# EAGLE design ibm (EAGLE 9.6.2)
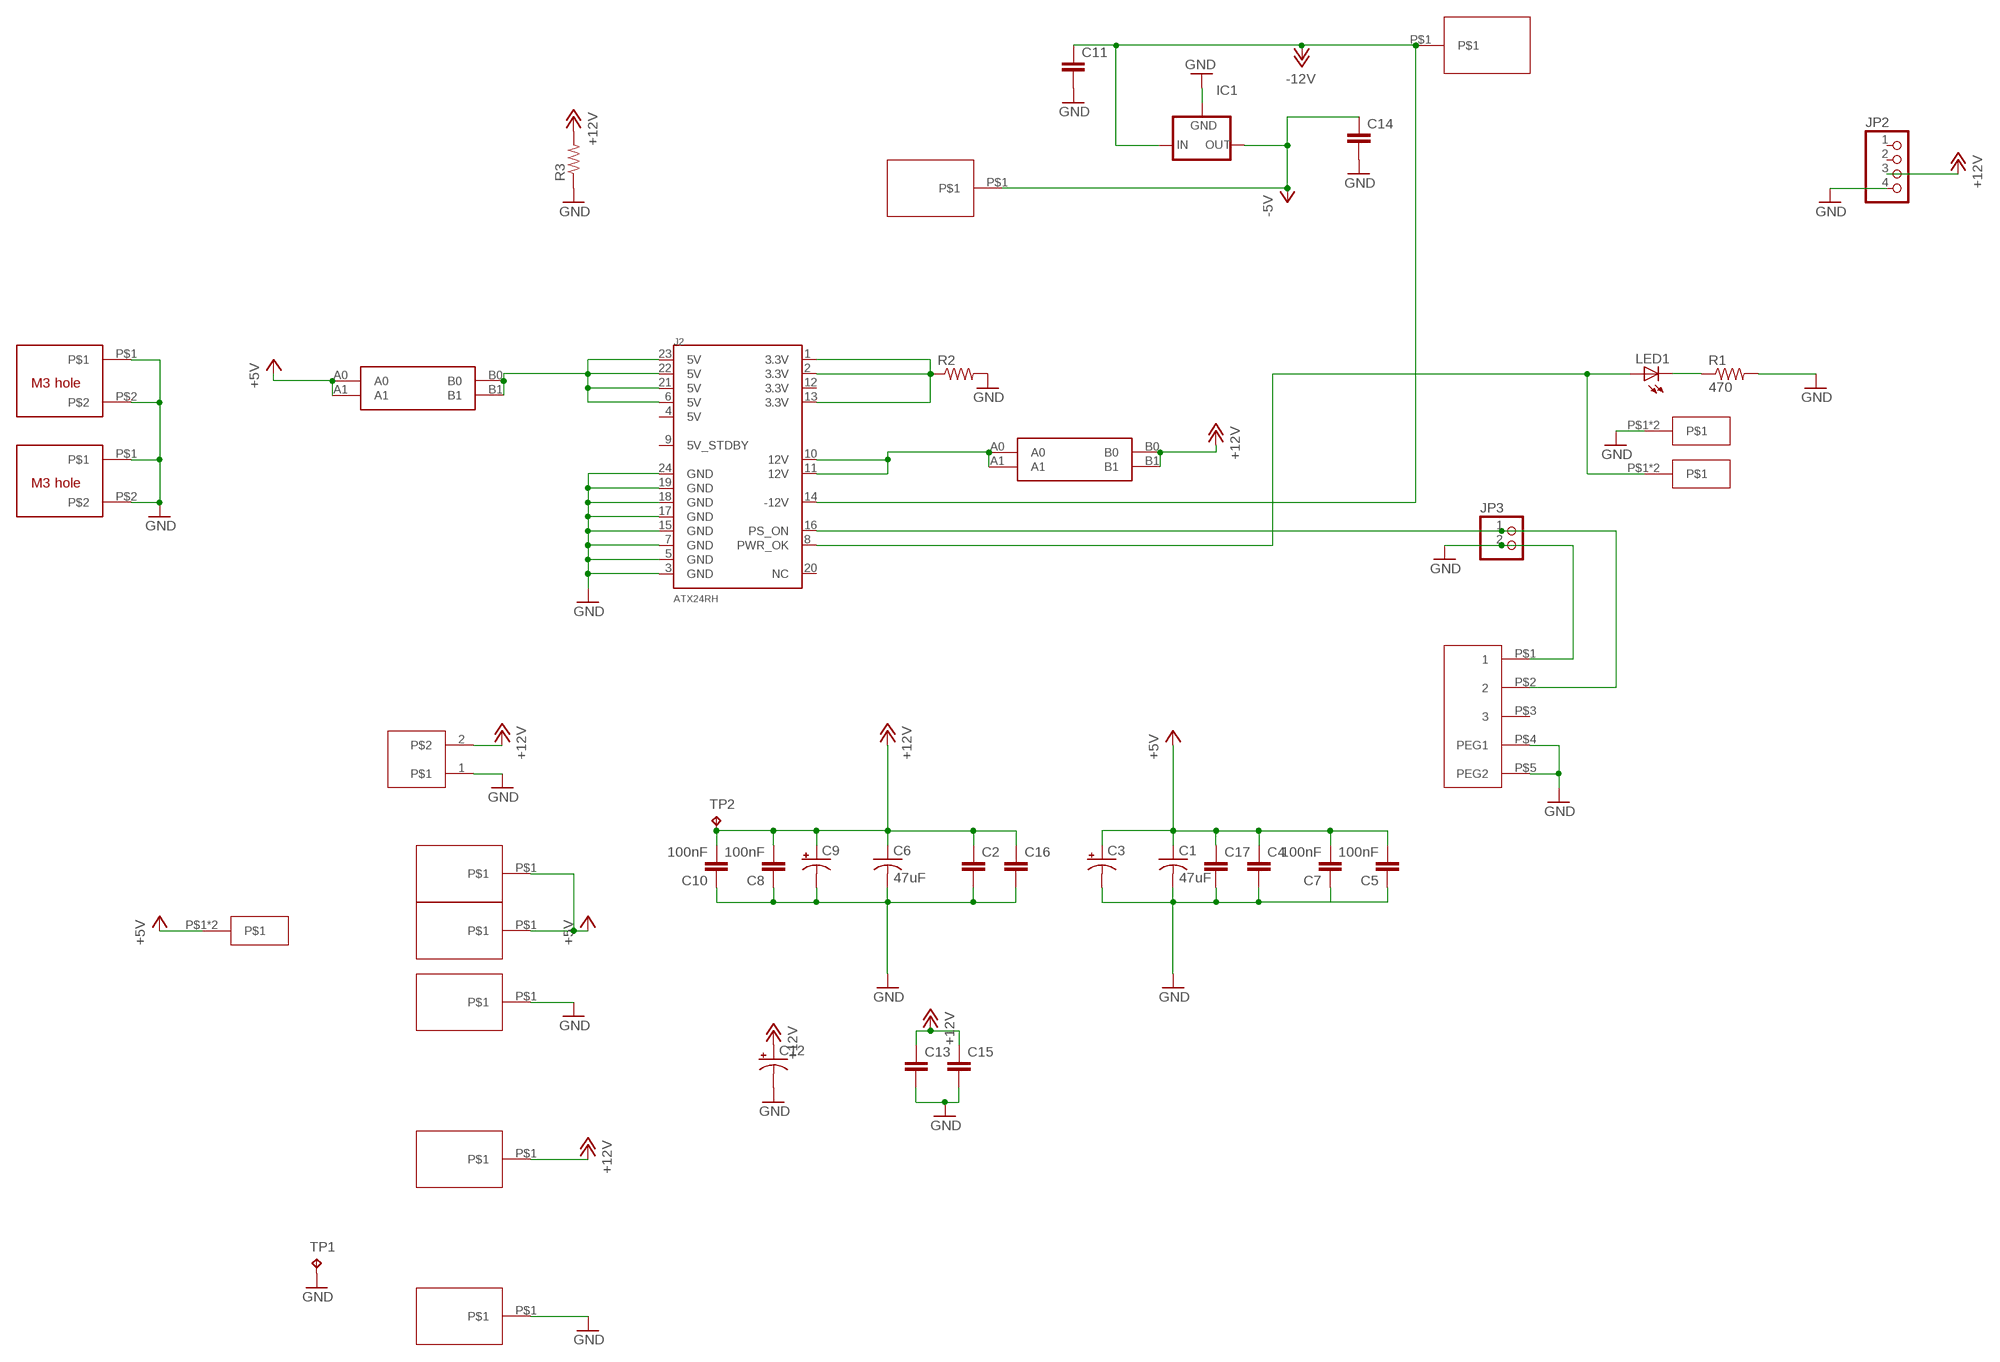
[diagram p0: schematic, sheet 1]

## Parts
C1  47uF  C-USC1210  [C1210]
C2  C5/2.5  [C5B2.5]
C3  CPOL-USE3.5-8  [E3,5-8]
C4  C5/2.5  [C5B2.5]
C5  100nF  CAP0805  [0805@1]
C6  47uF  C-USC1210  [C1210]
C7  100nF  CAP0805  [0805@1]
C8  100nF  CAP0805  [0805@1]
C9  CPOL-USE3.5-8  [E3,5-8]
C10  100nF  CAP0805  [0805@1]
C11  C5/2.5  [C5B2.5]
C12  CPOL-USE3.5-8  [E3,5-8]
C13  C5/2.5  [C5B2.5]
C14  C5/2.5  [C5B2.5]
C15  C5/2.5  [C5B2.5]
C16  C5/2.5  [C5B2.5]
C17  C5/2.5  [C5B2.5]
IC1  79XXS  [79XXS]
J2  ATX24RH  [ATX24_RIGHT_ANGLE]
JP2  PINHD-1X4/90  [1X04/90]
JP3  PINHD-1X2/90  [1X02/90]
LED1  LED5MM  [LED5MM]
R1  470  R-US_0207/10  [0207/10]
R2  R-US_0411/15  [0411/15]
R3  R-US_0411/15  [0411/15]
TP1  TPPAD1-13  [P1-13]
TP2  TPPAD1-13  [P1-13]
U$1  ISA  [ISAPAD]
U$2  CAR_FUSE_HOLDER3IN1  [FUSE_HOLDER_3IN1]
U$3  28FLAG  [2.8FLAG]
U$4  ROCKSW  [ROCKSW]
U$5  M3_MOUNTING_HOLE  [M3_MOUNTING_HOLE_PACK]
U$6  M3_MOUNTING_HOLE  [M3_MOUNTING_HOLE_PACK]
U$7  ISA  [ISAPAD]
U$8  CAR_FUSE_HOLDER3IN1  [FUSE_HOLDER_3IN1]
U$9  ISA  [ISAPAD]
U$10  ISA  [ISAPAD]
U$11  28FLAG  [2.8FLAG]
U$12  CRT2P  [CRT2P]
U$13  ISA  [ISAPAD]
U$14  28FLAG  [2.8FLAG]
U$15  ISA  [ISAPAD]
U$16  ISA  [ISAPAD]

## Nets
+5V: C1.1 C3.+ C4.1 C5.2 C7.2 C17.1 U$1.P$1 U$8.A0 U$8.A1 U$11.P$1 U$11.P$2 U$16.P$1
+12V: C2.1 C6.1 C8.2 C9.+ C10.2 C12.+ C13.1 C15.1 C16.1 JP2.3 R3.2 TP2.TP U$2.B0 U$2.B1 U$12.2 U$13.P$1
-5V: C14.1 IC1.OUT U$7.P$1
-12V: C11.1 IC1.IN J2.14(-12V) U$10.P$1
GND: C1.2 C2.2 C3.- C4.2 C5.1 C6.2 C7.1 C8.1 C9.- C10.1 C11.2 C12.- C13.2 C14.2 C15.2 C16.2 C17.2 IC1.GND J2.3(GND) J2.5(GND) J2.7(GND) J2.15(GND) J2.17(GND) J2.18(GND) J2.19(GND) J2.24(GND) JP2.4 JP3.2 R1.2 R2.2 R3.1 TP1.TP U$4.P$1 U$4.P$4(PEG1) U$4.P$5(PEG2) U$5.P$1 U$5.P$2 U$6.P$1 U$6.P$2 U$9.P$1 U$12.1 U$14.P$1 U$14.P$2 U$15.P$1
N$1: J2.1(3.3V) J2.2(3.3V) J2.13(3.3V) R2.1
N$3: J2.16(PS_ON) JP3.1 U$4.P$2
N$4: J2.8(PWR_OK) LED1.A U$3.P$1 U$3.P$2
N$6: J2.6(5V) J2.21(5V) J2.22(5V) J2.23(5V) U$8.B0 U$8.B1
N$8: J2.10(12V) J2.11(12V) U$2.A0 U$2.A1
N$12: LED1.K(C) R1.1
Unconnected: J2.4(5V) J2.9(5V_STDBY) J2.12(3.3V) J2.20(NC) JP2.1 JP2.2 U$4.P$3

## Library data of the parts
C1 C6 = clock:C-US: CAPACITOR, American symbol
C2 C4 C11 C13-C17 = capacitor-wima:C: CAPACITOR naming: grid - package width
C3 C9 C12 = adafruit_changed:CPOL-US: POLARIZED CAPACITOR, American symbol
C5 C7 C8 C10 = clock:CAP: Capacitor Standard 0603 ceramic capacitor, and 0.1" leaded capacitor.
IC1 = v-reg:79XXS: VOLTAGE REGULATOR
J2 = blade:ATX24: ATX24 Pin Power Supply Connector This is a good connector for connecting a computer power supply to a PCB. It's massive, but provides many amps of power at 5V and 12V. SKU: PRT-09498
JP2 = pinhead:PINHD-1X4: PIN HEADER
JP3 = pinhead:PINHD-1X2: PIN HEADER
LED1 = adafruit:LED: LED OSRAM: - CHIPLED LG R971, LG N971, LY N971, LG Q971, LY Q971, LO R971, LY R971 LH N974, LH R974 LS Q976, LO Q976, LY Q976 LO Q996 - Hyper CHIPLED LW Q18S LB Q993, LB Q99A, LB R99A - SideLED LS A670, LO A670, LY A670, LG A670, LP A670 LB A673, LV A673, LT A673, LW A673 LH A674 LY A675 LS A676, LA A676, LO A676, LY A676, LW A676 LS A679, LY A679, LG A679 - Hyper Micro SIDELED® LS Y876, LA Y876, LO Y876, LY Y876 LT Y87S - SmartLED LW L88C, LW L88S LB L89C, LB L89S, LG L890 LS L89K, LO L89K, LY L89K LS L896, LA L896, LO L896, LY L896 - TOPLED LS T670, LO T670, LY T670, LG T670, LP T670 LSG T670, LSP T670, LSY T670, LOP T670, LYG T670 LG T671, LOG T671, LSG T671 LB T673, LV T673, LT T673, LW T673 LH T674 LS T676, LA T676, LO T676, LY T676, LB T676, LH T676, LSB T676, LW T676 LB T67C, LV T67C, LT T67C, LS T67K, LO T67K, LY T67K, LW E67C LS E67B, LA E67B, LO E67B, LY E67B, LB E67C, LV E67C, LT E67C LW T67C LS T679, LY T679, LG T679 LS T770, LO T770, LY T770, LG T770, LP T770 LB T773, LV T773, LT T773, LW T773 LH T774 LS E675, LA E675, LY E675, LS T675 LS T776, LA T776, LO T776, LY T776, LB T776 LHGB T686 LT T68C, LB T68C - Hyper Mini TOPLED® LB M676 - Mini TOPLED Santana® LG M470 LS M47K, LO M47K, LY M47K Source: http://www.osram.convergy.de/
R1 = adafruit:R-US_: RESISTOR, American symbol
R2 R3 = adafruit_changed:R-US_: RESISTOR, American symbol
TP1 TP2 = testpad:TP: Test pad
U$1 U$7 U$9 U$10 U$13 U$15 U$16 = blade:ISA
U$2 U$8 = atx_power_control:CAR_FUSE_HOLDER
U$3 U$11 U$14 = blade:28FLAG
U$4 = apricot:ROCKSW
U$5 U$6 = apricot:M3_MOUNTING_HOLE
U$12 = blade:CRT2P

## Board
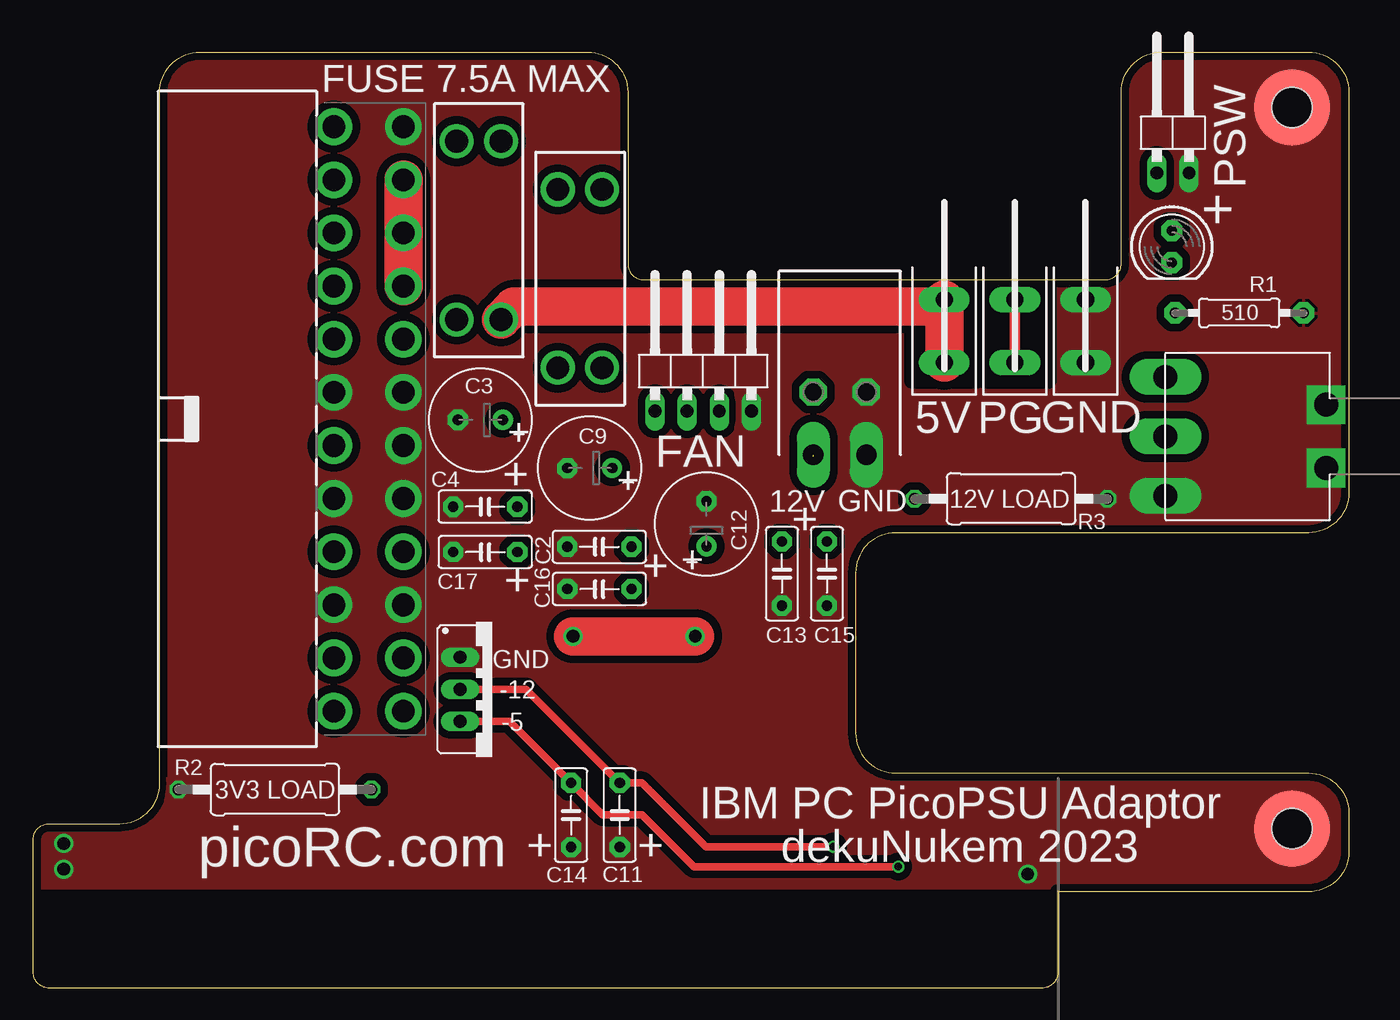
[diagram p1: board, top side]
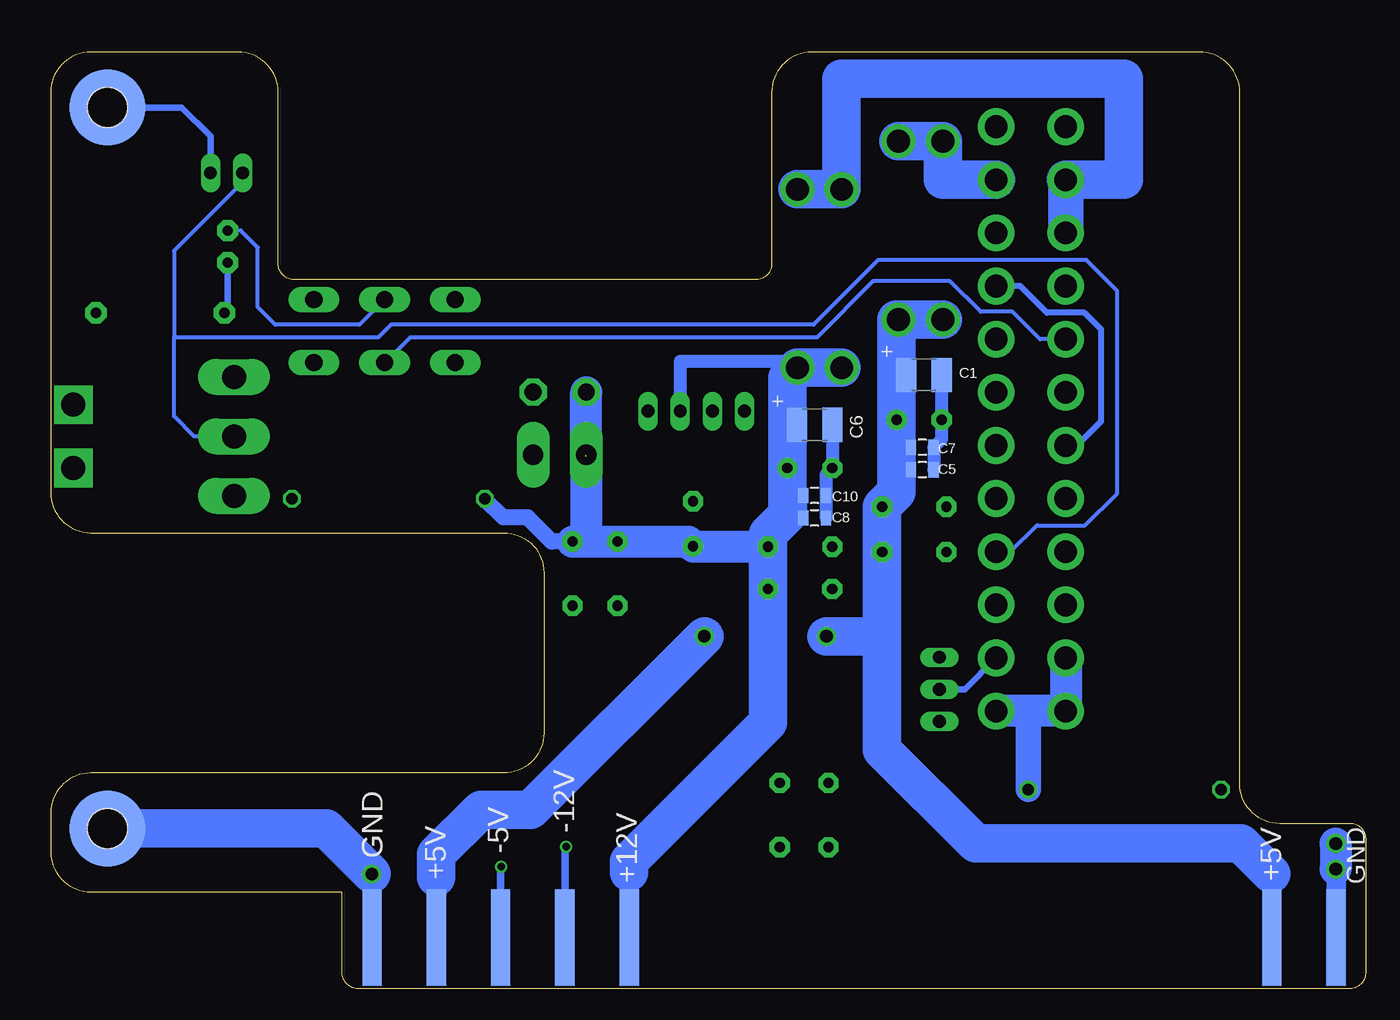
[diagram p2: board, bottom side, seen from below]

Size 104 x 74 mm. Coordinates in mm from the lower left corner, seen from the top.
Outline: 0,1.27 0,11.73 arc-90 1.27,13 6.83,13 arc90 10,16.18 10,70.83 arc-90 13.18,74 43.83,74 arc-90 47,70.83 47,57.27 arc90 48.27,56 84.73,56 arc90 86,57.27 86,70.83 arc-90 89.17,74 100.83,74 arc-90 104,70.83 104,39.17 arc-90 100.83,36 68.17,36 arc90 65,32.83 65,20.18 arc90 68.17,17 100.83,17 arc-90 104,13.82 104,10.79 arc-90 100.83,7.62 81,7.62 81,1.27 arc-90 79.73,0 1.27,0 arc-90 0,1.27
Copper layers (1*16): Top 0.035mm / dielectric 1.5mm / Bottom 0.035mm
Design rules "deku_2layer_6mil *": minimum track width 6mil, minimum drill 15mil, track to track 20mil, track to pad 16mil, pad to pad 16mil, via to via 16mil, smd to smd 6mil, copper to edge 20mil, drill to drill 20mil, minimum pad ring 7mil, minimum via ring 7mil, stop-mask expansion 4mil, vias tented up to drill 25mil, thermal gap 10mil
tRestrict: area 69.5,48 to 74.5,55.8; area 75.2,48 to 80.3,55.8

### Footprints (pad centres in the part's own frame; a part is rotated, then mirrored left to right if it is on the bottom)
C1210 = smd 1.6 x 2.7: 1 -1.4,0; 2 1.4,0
C5B2.5 = drill 0.813 pad 1.6 octagon: 1 -2.54,0; 2 2.54,0
E3,5-8 = drill 0.813 pad 1.6: + -1.778,0 | drill 0.813 pad 1.6 octagon: - 1.778,0
0805@1 = smd 0.8 x 1.2: 1 -0.9,0; 2 0.9,0
79XXS = drill 1.016 long: GND -2.54,-2.54; IN 0,-2.54; OUT 2.54,-2.54
ATX24_RIGHT_ANGLE = drill 1.8 pad 2.9: 1 23.1,4.76; 2 18.9,4.76; 3 14.7,4.76; 4 10.5,4.76; 5 6.3,4.76; 6 2.1,4.76; 7 -2.1,4.76; 8 -6.3,4.76; 9 -10.5,4.76; 10 -14.7,4.76; 11 -18.9,4.76; 12 -23.1,4.76; 13 23.1,10.26; 14 18.9,10.26; 15 14.7,10.26; 16 10.5,10.26; 17 6.3,10.26; 18 2.1,10.26; 19 -2.1,10.26; 20 -6.3,10.26; 21 -10.5,10.26; 22 -14.7,10.26; 23 -18.9,10.26; 24 -23.1,10.26
1X04/90 = drill 1.016 long: 1 -3.81,-3.81; 2 -1.27,-3.81; 3 1.27,-3.81; 4 3.81,-3.81
1X02/90 = drill 1.016 long: 1 -1.27,-3.81; 2 1.27,-3.81
LED5MM = drill 0.813 pad 1.676 octagon: A -1.27,0; K 1.27,0
0207/10 = drill 0.813 pad 1.676 octagon: 1 -5.08,0; 2 5.08,0
0411/15 = drill 0.914 octagon: 1 -7.62,0; 2 7.62,0
P1-13 = drill 1.321 pad 2.159 octagon: TP 0,0
ISAPAD = smd 1.524 x 7.62: P$1 0,0
FUSE_HOLDER_3IN1 = drill 1.8: A0 -7.05,1.75; A1 -7.05,-1.75; B0 7.05,1.75; B1 7.05,-1.75
2.8FLAG = drill 1.35 long: P$1 -2.5,0; P$2 2.5,0
ROCKSW = drill 1.9 long: P$1 0,4.7; P$2 0,0; P$3 0,-4.7 | drill 1.9 pad 3.048 square: P$4 -12.7,2.5; P$5 -12.7,-2.5
M3_MOUNTING_HOLE_PACK = smd 6 x 6 bottom: P$1 0,0 | smd 6 x 6: P$2 0,0 | hole 3.2: 0,0
CRT2P = drill 1.6 pad 2.6 long: 1 -2.1,0; 2 2.1,0

### Placement (x,y rotation side)
C1  34.97,48.48 0 bottom
C2  44.74,34.89 180 top
C3  35.35,44.92 180 top
C4  35.73,38.06 180 top
C5  35.09,40.98 180 bottom
C6  43.6,44.54 0 bottom
C7  35.09,42.76 180 bottom
C8  43.6,37.17 180 bottom
C9  43.98,41.11 180 top
C10  43.6,38.95 180 bottom
C11  46.35,13.69 270 top
C12  53.21,36.7 90 top
C13  59.18,32.77 270 top
C14  42.51,13.68 270 top
C15  62.74,32.77 270 top
C16  44.75,31.55 180 top
C17  35.73,34.47 180 top
IC1  36.27,23.62 270 top
J2  19,45 270 top
JP2  52.96,49.42 0 top
JP3  90.09,68.26 0 top
LED1  90,58.62 270 top
R1  95.34,53.38 0 top
R2  19.11,15.7 180 top
R3  77.29,38.69 180 top
TP1  65.85,47.12 0 top
TP2  61.65,47.12 0 top
U$1  73.51,4 0 bottom
U$2  43.22,56.1 270 top
U$3  77.6,51.94 90 top
U$4  89.5,43.62 180 top
U$5  99.5,69.62 270 top
U$6  99.5,12.62 270 top
U$7  68.42,4 180 bottom
U$8  35.22,59.91 90 top
U$9  78.59,4 180 bottom
U$10  63.35,4 180 bottom
U$11  72.01,51.94 90 top
U$12  63.75,42.16 180 top
U$13  58.27,4 180 bottom
U$14  83.19,51.94 90 top
U$15  2.39,4 180 bottom
U$16  7.47,4 180 bottom

### Tracks (layer width: path | path; a pad name or v marks a point on that pad's centre or on a via)
+5V  (via drill 1)
  Top 3.048: U$8.A1 37.99,53.87 72.01,53.87 U$11.P$2 U$11.P$1 | v52.32,27.81 v42.67,27.81
  Bottom 0.61: C1.1 36.37,45.68 C3.+ 37.12,43.89 C7.2 C5.2
  Bottom 1.016: U$1.P$1 73.51,8.76
  Bottom 1.27: 7.49,9.02 7.49,4.03 U$16.P$1
  Bottom 3.048: U$8.A0 U$8.A1 37.12,52.86 C3.+ 37.12,39.2 C4.1 C17.1 38.27,27.81 | 73.51,8.76 73.51,10.57 69.98,14.1 66.04,14.1 v52.32,27.81 | v42.67,27.81 38.27,27.81 | 38.27,27.81 38.27,18.84 30.86,11.43 9.91,11.43 7.49,9.02
+12V  (1 unrouted)
  Bottom 0.61: 58.29,9.14 58.29,4.03 U$13.P$1 | C6.1 45.76,43.78 C9.+ 45.76,40.21 C10.2 C8.2
  Bottom 1.016: U$2.B0 45.48,49.55 54.23,49.55 JP2.3
  Bottom 1.27: C15.1 64.39,35.31 66.29,37.21 68.2,37.21 R3.2
  Bottom 2.54: C2.1 53.17,34.89 C12.+ 53.59,35.31 C13.1 C15.1 61.65,35.31 61.65,42.04 | U$12.2 TP2.TP
  Bottom 3.048: U$2.B1 U$2.B0 45.76,48.26 C9.+ 45.76,37.43 47.28,35.9 C2.1 C16.1 47.29,21.01 58.29,10.01 58.29,9.14
-5V  (via drill 0.6)
  Top 0.61: IC1.OUT 37.65,21.08 C14.1 45.02,13.72 48.13,13.72 52.25,9.6 v68.38,9.6
  Bottom 0.61: U$7.P$1 68.42,9.55 v68.38,9.6
-12V  (via drill 0.6)
  Top 0.61: IC1.IN 38.96,23.62 C11.1 48.13,16.23 53.18,11.18 v63.25,11.18
  Bottom 0.508: J2.14 31.74,23.62 IC1.IN
  Bottom 0.61: U$10.P$1 63.35,11.07 v63.25,11.18
GND  (via drill 1)
  Bottom 0.508: U$5.P$2 93.62,69.62 91.36,67.36 JP3.2
  Bottom 1.016: v78.61,9.02 78.61,4.03 U$9.P$1 | C1.2 C3.- 33.57,43.38 C7.1 C5.1 | C6.2 C9.- 42.7,40.61 C10.1 C8.1
  Bottom 1.524: U$15.P$1 2.39,9.37 v2.41,9.4
  Bottom 2.54: v2.41,11.43 v2.41,9.4
  Bottom 3.048: v78.61,9.02 82.22,12.62 U$6.P$2
  pour Top (isolate 0.61): -20.13,7.87 124.97,7.87 124.97,79 -20.13,79
  pour Top (no thermals): 32.26,46.35 34.92,46.35 34.92,43.56 32.26,43.56
  pour Top (no thermals): 31.88,39.5 34.54,39.5 34.54,33.02 31.88,33.02
  pour Top (no thermals): 40.89,42.42 43.56,42.42 43.56,39.62 40.89,39.62
  pour Top (no thermals): 40.89,36.32 43.56,36.32 43.56,30.23 40.89,30.23
  pour Top (no thermals): 57.91,31.37 64.01,31.37 64.01,28.83 57.91,28.83
  pour Top (no thermals): 51.94,39.88 54.61,39.88 54.61,37.08 51.94,37.08
  pour Top (no thermals): 55.5,47.37 58.17,47.37 58.17,43.69 55.5,43.69
  pour Top (no thermals): 31.88,25.02 31.88,27.69 35.56,27.69 35.56,25.02
  pour Top (no thermals): 41.15,9.91 41.15,12.32 47.62,12.32 47.62,9.91
  pour Top (no thermals): 90.3,66.17 92.46,66.17 92.46,62.48 90.3,62.48
  pour Top (no thermals): 10.41,16.64 12.45,16.64 12.45,14.61 10.41,14.61
  pour Top (no thermals): 64.52,48.51 67.18,48.51 67.18,45.72 64.52,45.72
  pour Top (no thermals): 83.95,39.88 86.11,39.88 86.11,37.47 83.95,37.47
N$1
  Bottom 2.032: R2.1 26.73,21.83 26.8,21.9
  Bottom 2.54: J2.2 J2.1 26.8,21.9 J2.13
N$3
  Bottom 0.305: J2.16 28.11,34.5 26.04,36.58 22.23,36.58 19.68,39.12 19.68,55.12 22.12,57.56 38.58,57.56 43.69,52.45 77.09,52.45 78.11,51.44 94.23,51.44 | U$4.P$2 92.64,43.62 94.23,45.21 94.23,51.44 | JP3.1 88.82,63.71 94.23,58.29 94.23,51.44
N$4
  Top 0.813: U$3.P$2 U$3.P$1
  Bottom 0.305: J2.8 25.79,51.3 27.96,53.47 30.48,53.47 32.89,55.88 38.99,55.88 43.43,51.44 75.56,51.44 77.56,49.44 U$3.P$1 | U$3.P$2 79.59,52.45 86.23,52.45 87.63,53.85 87.63,58.55 88.97,59.89 LED1.A
N$6
  Top 3.048: J2.21 J2.22 J2.23
  Bottom 0.457: J2.6 22.87,42.9 20.95,44.82 20.95,52.07 22.28,53.39 25.25,53.39 27.36,55.5 J2.21
  Bottom 3.048: J2.23 33.47,63.9 U$8.B0 U$8.B1
N$8
  Bottom 2.794: J2.10 J2.11
  Bottom 3.048: J2.11 19.18,63.9 19.18,71.88 41.47,71.88 U$2.A1 U$2.A0
N$12
  Bottom 0.305: 90,53.64 R1.1
  Bottom 0.508: LED1.K 90,53.64

### Text on the board
tNames: external switch kit: / long dupot cable (1m+) / hooks or / aligator clips / maybe both? | FUSE 7.5A MAX | PSW | + | 5155 kit: / 2P PCB connector / 2P cable / additional caps | 510 | 5V | PG | GND | + | FAN | + | + | 12V | GND | 12V LOAD | + | + | + | + | GND | -12 | -5 | 3V3 LOAD | IBM PC PicoPSU Adaptor / dekuNukem 2023 | picoRC.com | + | +
bNames: -12V | GND | -5V | +5V | +12V | +5V | GND